# Altium schematic sheet microGate.SchDoc
size A3
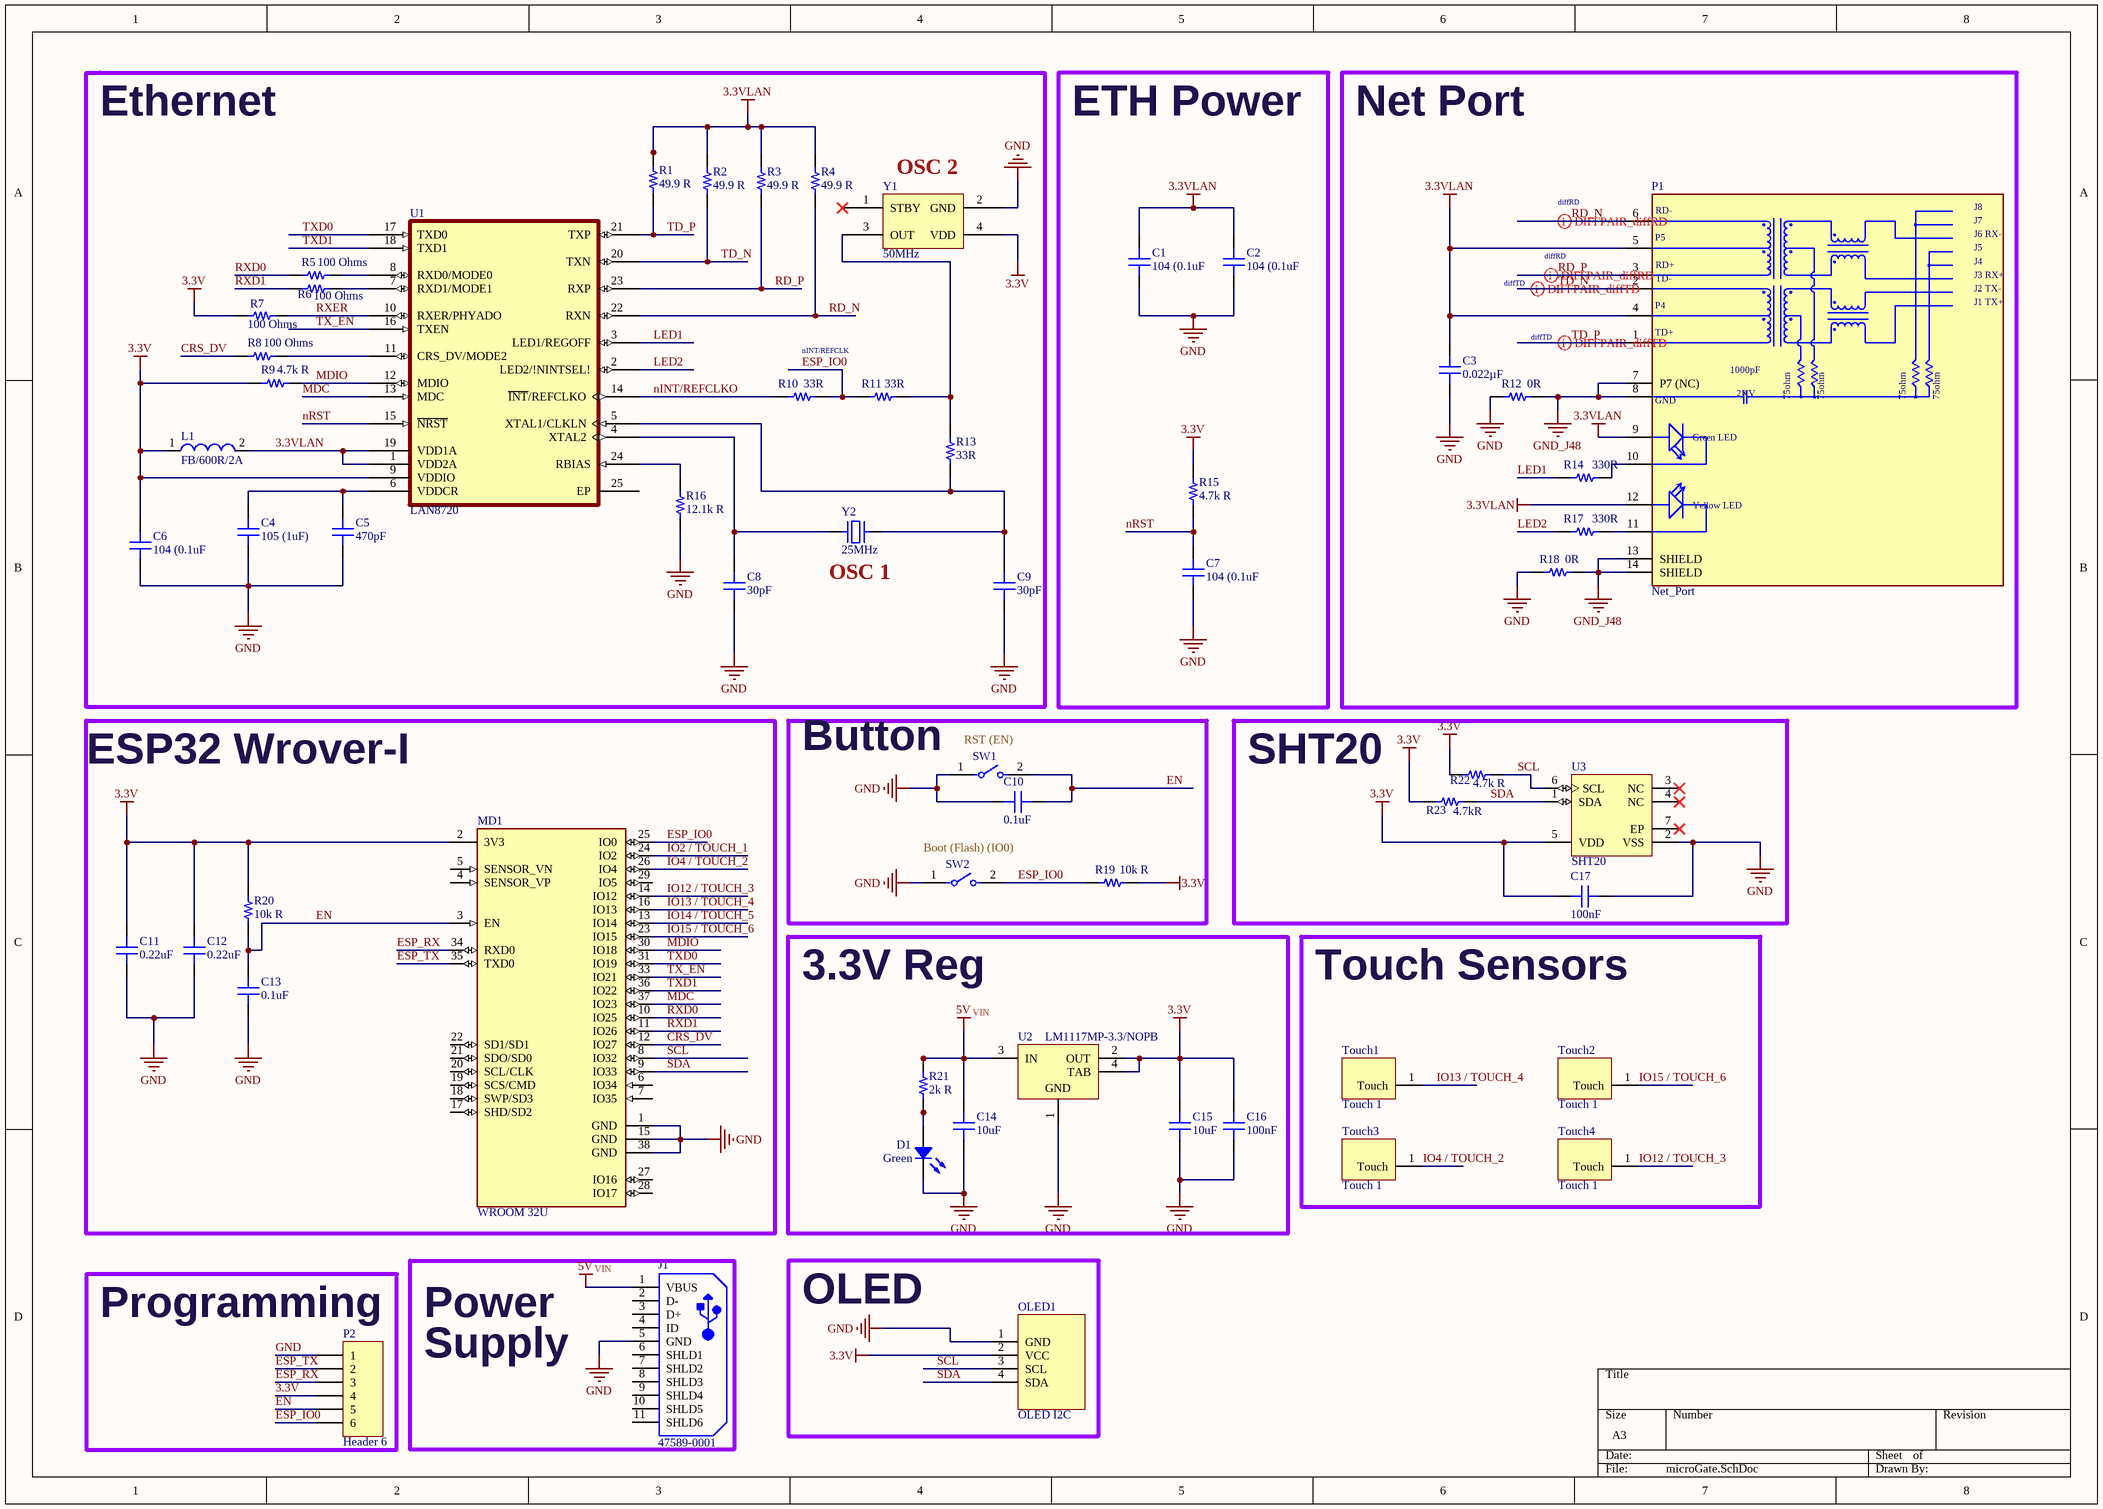
[diagram p0: microGate.SchDoc]

## Parts
C1  104 (0.1uF  [CAP 0805_2012]
C2  104 (0.1uF  [CAP 0805_2012]
C3  0.022µF  [CAP 0805_2012]
C4  105 (1uF)  [CAP 0805_2012]
C5  470pF  [CAP 0805_2012]
C6  104 (0.1uF  [CAP 0805_2012]
C7  104 (0.1uF  [CAP 0805_2012]
C8  30pF  [CAP 0805_2012]
C9  30pF  [CAP 0805_2012]
C10  0.1uF  [CAP 0805_2012]
C11  0.22uF  [CAP 0805_2012]
C12  0.22uF  [CAP 0805_2012]
C13  0.1uF  [CAP 0805_2012]
C14  10uF  [CAP 0805_2012]
C15  10uF  [CAP 0805_2012]
C16  100nF  [CAP 0805_2012]
C17  100nF  [CAP 0805_2012]
D1  Green  [LED 0603_1608 GREEN]
J1  47589-0001  [MOLX-47589-0001_V]
L1  FB/600R/2A  [SMD-0805]
MD1  WROOM 32U  [ESP32 WROOM 32U]
OLED1  OLED I2C  [OLED I2C]
P1  Net_Port  [HR911105A]
P2  Header 6  [HDR1X6]
R1  49.9 R  [RES 0805_2012]
R2  49.9 R  [RES 0805_2012]
R3  49.9 R  [RES 0805_2012]
R4  49.9 R  [RES 0805_2012]
R5  100 Ohms  [RES 0805_2012]
R6  100 Ohms  [RES 0805_2012]
R7  100 Ohms  [RES 0805_2012]
R8  100 Ohms  [RES 0805_2012]
R9  4.7k R  [RES 0805_2012]
R10  33R  [RES 0805_2012]
R11  33R  [RES 0805_2012]
R12  value 0R  [RES 0805_2012]  (hidden comment: 33R)
R13  33R  [RES 0805_2012]
R14  value 330R  [RES 0805_2012]  (hidden comment: 33R)
R15  value 4.7k R  [RES 0805_2012]  (hidden comment: 33R)
R16  value 12.1k R  [RES 0805_2012]  (hidden comment: 33R)
R17  value 330R  [RES 0805_2012]  (hidden comment: 33R)
R18  value 0R  [RES 0805_2012]  (hidden comment: 33R)
R19  value 10k R  [RES 0805_2012]  (hidden comment: 33R)
R20  value 10k R  [RES 0805_2012]  (hidden comment: 33R)
R21  value 2k R  [RES 0805_2012]  (hidden comment: 33R)
R22  value 4.7k R  [RES 0805_2012]  (hidden comment: 33R)
R23  value 4.7kR  [RES 0805_2012]  (hidden comment: 33R)
SW1  (no value)  [FP-B3U-1000P-B-MFG]
SW2  (no value)  [FP-B3U-1000P-B-MFG]
Touch1  Touch 1  [Touch]
Touch2  Touch 1  [Touch]
Touch3  Touch 1  [Touch]
Touch4  Touch 1  [Touch]
U1  LAN8720  [LAN8720 FOOT]
U2  LM1117MP-3.3/NOPB  [DCY0004A_L]
U3  SHT20  [SENS-SHT2X-6_V]
Y1  50MHz  [ABRACON ASDMB]
Y2  25MHz  [ABRACON ABLS]

## Blocks framed on the sheet
Ethernet: C4-C6 C8 C9 L1 R1-R11 R13 R16 U1 Y1 Y2
ETH Power: C1 C2 C7 R15
Net Port: C3 P1 R12 R14 R17 R18
ESP32 Wrover-I: C11-C13 MD1 R20
Button: C10 R19 SW1 SW2
SHT20: C17 R22 R23 U3
3.3V Reg: C14-C16 D1 R21 U2
Touch Sensors: Touch1-Touch4
Programming: P2
OLED: OLED1

## Nets
3.3V: C6.2 C11.2 C12.2 C15.2 C16.2 C17.1 L1.1 MD1.2(3V3) OLED1.2(VCC) P2.4 R7.1 R9.1 R15.2 R19.2 R20.2 R22.1 R23.1 U1.9(VDDIO) U2.2(OUT) U2.4(TAB) U3.5(VDD) Y1.4(VDD)
3.3VLAN: C1.2 C2.2 C3.2 L1.2 P1.4(P4) P1.5(P5) P1.9(GA) P1.12(YA) R1.2 R2.2 R3.2 R4.2 U1.1(VDD2A) U1.19(VDD1A)
5V: C14.2 J1.1(VBUS) R21.2 U2.3(IN)
GND: C1.1 C2.1 C3.1 C4.1 C5.1 C6.1 C7.1 C8.1 C9.1 C10.1 C11.1 C12.1 C13.1 C14.1 C15.1 C16.1 C17.2 D1.2 J1.5(GND) MD1.1(GND) MD1.15(GND) MD1.38(GND) OLED1.1(GND) P2.1 R12.1 R16.1 R18.1 SW1.1 SW2.1 U2.1(GND) U3.2(VSS) Y1.2(GND)
GND_J48: P1.7(P7_(NC)) P1.8(GND) P1.13(SHIELD) P1.14(SHIELD) R12.2 R18.2
CRS_DV: MD1.12(IO27) R8.1
EN: C10.2 C13.2 MD1.3(EN) P2.5 R20.1 SW1.2
ESP_IO0: MD1.25(IO0) P2.6 R10.2 R11.1 R19.1 SW2.2
ESP_RX: MD1.34(RXD0) P2.3
ESP_TX: MD1.35(TXD0) P2.2
IO2 / TOUCH_1: MD1.24(IO2)
IO4 / TOUCH_2: MD1.26(IO4) Touch3.1(Touch)
IO12 / TOUCH_3: MD1.14(IO12) Touch4.1(Touch)
IO13 / TOUCH_4: MD1.16(IO13) Touch1.1(Touch)
IO14 / TOUCH_5: MD1.13(IO14)
IO15 / TOUCH_6: MD1.23(IO15) Touch2.1(Touch)
LED1: R14.1 U1.3(LED1/REGOFF)
LED2: R17.1 U1.2(LED2/!NINTSEL!)
MDC: MD1.37(IO23) U1.13(MDC)
MDIO: MD1.30(IO18) R9.2 U1.12(MDIO)
nINT/REFCLKO: R10.1 U1.14(~{INT}/REFCLKO)
nRST: C7.2 R15.1 U1.15(~{NRST})
RD_N: P1.6(RD-) R4.1 U1.22(RXN)
RD_P: P1.3(RD+) R3.1 U1.23(RXP)
RXD0: MD1.10(IO25) R5.1
RXD1: MD1.11(IO26) R6.1
RXER: R7.2 U1.10(RXER/PHYADO)
SCL: MD1.8(IO32) OLED1.3(SCL) R22.2 U3.6(SCL)
SDA: MD1.9(IO33) OLED1.4(SDA) R23.2 U3.1(SDA)
TD_N: P1.2(TD-) R2.1 U1.20(TXN)
TD_P: P1.1(TD+) R1.1 U1.21(TXP)
TX_EN: MD1.33(IO21) U1.16(TXEN)
TXD0: MD1.31(IO19) U1.17(TXD0)
TXD1: MD1.36(IO22) U1.18(TXD1)
NetC4_2: C4.2 C5.2 U1.6(VDDCR)
NetC8_2: C8.2 U1.4(XTAL2) Y2.1
NetC9_2: C9.2 R13.1 U1.5(XTAL1/CLKLN) Y2.2
NetD1_1: D1.1 R21.1
NetP1_10: P1.10(GC) R14.2
NetP1_11: P1.11(YC) R17.2
NetR5_2: R5.2 U1.8(RXD0/MODE0)
NetR6_2: R6.2 U1.7(RXD1/MODE1)
NetR8_2: R8.2 U1.11(CRS_DV/MODE2)
NetR11_2: R11.2 R13.2 Y1.3(OUT)
NetR16_2: R16.2 U1.24(RBIAS)

Not connected (* = marked no-connect by the designer): J1 2(D-) 3(D+) 4(ID) 6(SHLD1) 7(SHLD2) 8(SHLD3) 9(SHLD4) 10(SHLD5) 11(SHLD6); MD1 4(SENSOR_VP) 5(SENSOR_VN) 6(IO34) 7(IO35) 17(SHD/SD2) 18(SWP/SD3) 19(SCS/CMD) 20(SCL/CLK) 21(SDO/SD0) 22(SD1/SD1) 27(IO16) 28(IO17) 29(IO5); U1 25(EP); U3 3(NC)* 4(NC)* 7(EP)*; Y1 1(STBY)*

## Layout directives
differential pair; differential pair class diffRD: RD_N, RD_P
differential pair; differential pair class diffTD: TD_N, TD_P

## Notes on the sheet
- (near Y1) OSC 2
- nINT/REFCLK
- (near Y2) OSC 1
- (near SW1) RST (EN)
- Boot (Flash) (IO0)
- VIN
- Power
- Supply
- (in symbol HR911105A) J8; J7; J6 RX-; J5; J4; J3 RX+; J2 TX-; J1 TX+; 1000pF; 2KV; 75ohm; Green LED; Yellow LED

## Library data of the parts
C1-C17 = C0805C220J5RAC7800: CAP CER SMD 0805 22PF 5% 50V X7R; Manufacturer: KEMET; Part Number: C0805C220J5RAC7800; Applications: Bypass, Decoupling; Capacitance: 22pF; ComponentLink1Description: Datasheet; ComponentLink1URL: https://api.kemet.com/component-edge/download/datasheet/C0805C220J5RAC7800.pdf; ComponentLink2Description: DigiKey Link; ComponentLink2URL: http://digikey.com/product-detail/en/kemet/C0805C220J5RAC7800/399-17625-1-ND/8572625; Device Package: 0805 (2012 Metric); LastUpdated: 02.09.2020 01:04:09; Lifecycle Status: Active; Minimum Order: 1; Mounting Type: Surface Mount, MLCC; Operating Temperature: -55°C ~ 125°C; Package / Case: 0805 (2012 Metric); Packaging: TapeAndReel; PartId: 17442; Part Status: Active; Price: 0.03; Series: SMD Comm X7R; Size / Dimension: 0.079" L x 0.049" W (2.00mm x 1.25mm); Supplier 1: DigiKey; Supplier Part Number 1: 399-17625-1-ND; Temperature Coefficient: X7R; Thickness (Max): 0.035" (0.88mm); Tolerance: ±5%; Voltage - Rated: 50V
  C1 C2 C6 C7: Value: 104 (0.1uF
  C3: Value: 0.022µF
  C4: Value: 105 (1uF)
  C5: Value: 470pF
  C8 C9: Value: 30pF
  C10 C13: Value: 0.1uF
  C11 C12: Value: 0.22uF
  C14 C15: Value: 10uF
  C16 C17: Value: 100nF
D1 = BG1111C-TR: LED GREEN DIFFUSED 1608 SMD; Manufacturer: Stanley Electric Co; Configuration: Standard; Current - Test: 20mA; Lens Color: White; Lens Size: 1.10mm x 0.80mm; Lens Style: Rectangle with Flat Top; Millicandela Rating: 2.4mcd; Viewing Angle: 153°, 146°; Voltage - Forward (Vf) (Typ): 2.1V; Wavelength - Dominant: 558nm; Wavelength - Peak: 555nm; Part Number: BG1111C-TR; Color: Green; ComponentLink1Description: Datasheet; ComponentLink1URL: http://www.stanley-components.com/php/downloaddatafile.php?rp=h1111c_e.pdf; ComponentLink2Description: DigiKey Link; ComponentLink2URL: http://digikey.com/product-detail/en/stanley-electric-co/BG1111C-TR/404-1005-1-ND/428888; Device Package: 0603 (1608 Metric); Height (Max): 0.90mm; LastUpdated: 02.09.2020 01:20:42; Lens Transparency: Diffused; Lifecycle Status: Active; Minimum Order: 1; Mounting Type: Surface Mount; Package / Case: 0603 (1608 Metric); Packaging: TapeAndReel; PartId: 669; Part Status: Active; Price: 0.09; Series: 1111C; Size / Dimension: 1.60mm L x 0.80mm W; Supplier 1: DigiKey; Supplier Part Number 1: 404-1005-1-ND; Supplier Device Package: 1608; Value: Green
J1 = CMP-2000-05610-1: Right Angle Female Type AB Micro USB Connector, 30 V, 1.8 A, -30 to 85 degC, RoHS, Tape and Reel; Number of Ports: 1Port; Current Rating: 1.8A; Brand: Molex; Connector Type: MicroUSBTypeABreceptacle; Number of Contacts: 5Contact; Voltage Rating: 30VAC; Color: Black; Product: MicroUSBTypeABConnectors; Package URL: http://www.molex.com/pdm_docs/sd/475890001_sd.pdf; Contact Plating: Gold; Datasheet URL: http://www.molex.com/webdocs/datasheets/pdf/en-us/0475890001_IO_CONNECTORS.pdf; Operating Temperature Range: -20Cto+85C; Termination Style: SMD/SMT; Mounting Angle: Right; Package Reference: 47589-0001; Gender: Female; Package Description: Micro USB Connector, Pitch 0.65 mm, 5 Positions, Body 7.5 x 5.6 mm; Mounting Technology: SurfaceMount; Contact Material: CopperAlloy; Packaging: Reel; RoHS: True; Standard: USB; Manufacturer URL: http://www.molex.com/; Manufacturer: Molex; Datasheet Version: 12/2016; Product Category: USBConnectors; Series: 47589
L1 = CMP-0220-00032-1: İsmi : 742792040 SMD EMI Suppression Ferrite Bead WE-CBF, Z = 600 Ohm; Impedance: 600 Ohm; PackageVersion: 2005; ComponentLink2Description: Datasheet; PackageDescription: Chip Inductor, 2-Leads, Body 2.0 x 1.2 mm; ComponentLink1URL: http://www.we-online.com; PackageReference: SMD-0805; DatasheetVersion: Dec-2005; ComponentLink2URL: http://www.we-online.de/katalog/media/pdf/742792040.pdf; ComponentLink1Description: Manufacturer Link
MD1 = ESP32 WROOM 32U
P1 = HR911105A
P2 = Header 6: Header, 6-Pin; LatestRevisionDate: 17-Jul-2002; LatestRevisionNote: Re-released for DXP Platform.; Publisher: Altium Limited
R1-R4 R9-R23 = RPC0805JT100R-UP: RES, PULSE, 0805, 5%, 100 OHM, 0; Manufacturer: Stackpole Electronics Inc; Power (Watts): 0.5W, 1/2W; Resistance: 100 Ohms; Temperature Coefficient: ±200ppm/°C; Part Number: RPC0805JT100R-UP; ComponentLink1Description: Datasheet; ComponentLink1URL: https://www.seielect.com/catalog/sei-rpc.pdf; ComponentLink2Description: DigiKey Link; ComponentLink2URL: http://digikey.com/product-detail/en/stackpole-electronics-inc/RPC0805JT100R-UP/RPC0805JT100R-UPCT-ND/10109071; Composition: Thick Film; Device Package: 0805 (2012 Metric); Features: Automotive AEC-Q200, Pulse Withstanding; Height - Seated (Max): 0.024" (0.60mm); LastUpdated: 02.09.2020 01:15:08; Lifecycle Status: Active; Minimum Order: 1; Number of Terminations: 2; Operating Temperature: -55°C ~ 155°C; Package / Case: 0805 (2012 Metric); Packaging: TapeAndReel; PartId: 35188; Part Status: Active; Price: 0.02; Ratings: AEC-Q200; Series: RPC; Size / Dimension: 0.079" L x 0.049" W (2.00mm x 1.25mm); Supplier 1: DigiKey; Supplier Part Number 1: RPC0805JT100R-UPCT-ND; Supplier Device Package: 0805; Tolerance: ±5%
  R1-R4: Value: 49.9 R
  R9: Value: 4.7k R
  R10 R11 R13: Value: 33R
R5-R8 = RPC0805JT100R-UP: RES, PULSE, 0805, 5%, 100 OHM, 0; Manufacturer: Stackpole Electronics Inc; Power (Watts): 0.5W, 1/2W; Temperature Coefficient: ±200ppm/°C; Part Number: RPC0805JT100R-UP; Value: 100 Ohms; ComponentLink1Description: Datasheet; ComponentLink1URL: https://www.seielect.com/catalog/sei-rpc.pdf; ComponentLink2Description: DigiKey Link; ComponentLink2URL: http://digikey.com/product-detail/en/stackpole-electronics-inc/RPC0805JT100R-UP/RPC0805JT100R-UPCT-ND/10109071; Composition: Thick Film; Device Package: 0805 (2012 Metric); Features: Automotive AEC-Q200, Pulse Withstanding; Height - Seated (Max): 0.024" (0.60mm); LastUpdated: 02.09.2020 01:15:08; Lifecycle Status: Active; Minimum Order: 1; Number of Terminations: 2; Operating Temperature: -55°C ~ 155°C; Package / Case: 0805 (2012 Metric); Packaging: TapeAndReel; PartId: 35188; Part Status: Active; Price: 0.02; Ratings: AEC-Q200; Resistance: 100 Ohms; Series: RPC; Size / Dimension: 0.079" L x 0.049" W (2.00mm x 1.25mm); Supplier 1: DigiKey; Supplier Part Number 1: RPC0805JT100R-UPCT-ND; Supplier Device Package: 0805; Tolerance: ±5%
SW1 SW2 = CMP-08834-000005-1: SWITCH TACTILE SPST-NO 0.05A 12V; Manufacturer Part Number: B3U-1000P-B; Manufacturer: Omron; Operating Force: 1.5N; Contact Current Rating: 50mA; Contact Resistance: 100mΩ; Electromechanical Life: 200000Cycles; Height: 1.75mm; Device Class L2: Switches; Temperature Range High: +70°C; Digikey Description: SWITCH TACTILE SPST-NO 0.05A 12V; Throw Configuration: SPST-NO; Ambient Temperature Range High: +70°C; Temperature: -25°C to +70°C; Lead Free: Yes; ComponentLink2URL: https://omronfs.omron.com/en_US/ecb/products/pdf/en-b3u.pdf; Device Class L3: Tactile Switches; Ambient Temperature Range Low: -25°C; Mount: Surface Mount; Automotive: No; Mouser Description: Tactile Switches Top Actuated with boss w/o ground; Octopart: https://octopart.com/b3u-1000p-b-omron-1057356; RoHS: TRUE; Package: 0; Device Class L1: Electromechanical; Voltage Rating Dc: 12V; Category: Switch; Temperature Range Low: -25°C; ComponentLink2Description: Datasheet
U2 = CMP-0062-01638-4: 800mA Low-Dropout Linear Regulator, 4-pin SOT-223, Pb-Free; Manufacturer: Texas Instruments; CompType: LDO IC; PackageTopMarking: XYTT*N05A; High-Reliability: Y; PowerWise: N; ComponentLink1URL: http://www.ti.com/general/docs/lit/getliterature.tsp?genericPartNumber=LM1117-N&fileType=pdf; PinCount: 4; PackageDescription: Molded SOT-223, 6.50 x 3.56 x 1.6mm Body, 4 Lead, 2.3mm Pitch; Code_IPC: SOT223-4; PartNumber: LM1117MP-3.3/NOPB; Code_JEDEC: TO-261-AA; RoHS: Y; PackageReference: DCY0004A; ComponentLink1Description: Datasheet URL
U3 = CMP-2000-05344-1: Humidity and Temperature Sensor IC, 2.1 to 3.6 V, -40 to 125 degC, 6-Pin DFN, RoHS, Tape and Reel; Manufacturer: Sensirion-AG; Accuracy: ±3%RH; Output: 12b; Response Time: 8s; Humidity Range: 0~100%RH; Voltage - Supply: 2.1V~3.6V; Output Type: I²C; Sensor Type: Humidity,Temperature; Manufacturer URL: http://www.sensirion.com/; Datasheet Version: Rev. 4, 05/2014; Sensitivity: -; Operating Temperature: -40degC~125degC; Category: Sensors,Transducers; Series: -; Mounting Type: SurfaceMount; Datasheet URL: http://datasheet.octopart.com/SHT20-Sensirion-datasheet-32015022.pdf; Family: Humidity,MoistureSensors
Y1 = ASDMB-50.000MHZ-EC-T: MEMS OSC XO 50.0000MHZ LVCMOS; Manufacturer: Abracon LLC; Current - Supply (Max): 16mA; Frequency Stability: ±50ppm; Function: Standby (Power Down); Voltage - Supply: 1.8V ~ 3.3V; Part Number: ASDMB-50.000MHZ-EC-T; Base Resonator: MEMS; ComponentLink1Description: Datasheet; ComponentLink1URL: https://abracon.com/Oscillators/ASDMB.pdf; ComponentLink2Description: DigiKey Link; ComponentLink2URL: http://digikey.com/product-detail/en/abracon-llc/ASDMB-50.000MHZ-EC-T/535-12143-1-ND/4199768; Frequency: 50MHz; Height - Seated (Max): 0.035" (0.90mm); LastUpdated: 02.09.2020 01:21:50; Lifecycle Status: Active; Minimum Order: 1; Mounting Type: Surface Mount; Operating Temperature: -20°C ~ 70°C; Output: LVCMOS; Package / Case: 4-SMD, No Lead; Packaging: TapeAndReel; PartId: 65; Part Status: Active; Price: 1.35; Series: ASDMB, Pure Silicon™; Size / Dimension: 0.098" L x 0.079" W (2.50mm x 2.00mm); Supplier 1: DigiKey; Supplier Part Number 1: 535-12143-1-ND; Type: XO (Standard); Value: 50MHz
Y2 = ABLS-25.000MHZ-D-FT: CRYSTAL 25.000MHZ 18PF SMD; Manufacturer: Abracon LLC; ESR (Equivalent Series Resistance): 40 Ohms; Frequency Stability: ±50ppm; Operating Mode: Fundamental; Part Number: ABLS-25.000MHZ-D-FT; ComponentLink1Description: Datasheet; ComponentLink1URL: https://abracon.com/Resonators/abls.pdf; ComponentLink2Description: DigiKey Link; ComponentLink2URL: http://digikey.com/product-detail/en/abracon-llc/ABLS-25.000MHZ-D-FT/535-14356-1-ND/8582117; Frequency: 25MHz; Frequency Tolerance: ±50ppm; Height - Seated (Max): 0.165" (4.20mm); LastUpdated: 02.09.2020 01:21:46; Lifecycle Status: Active; Load Capacitance: 18pF; Minimum Order: 0; Mounting Type: Surface Mount; Operating Temperature: -40°C ~ 85°C; Package / Case: HC-49/US; Packaging: TapeAndReel; PartId: 19; Part Status: Active; Price: 0.18; Series: ABLS; Size / Dimension: 0.449" L x 0.185" W (11.40mm x 4.70mm); Supplier 1: DigiKey; Supplier Part Number 1: 535-14356-1-ND; Type: MHz Crystal; Value: 25MHz